# Altium schematic sheet Sheet1.SchDoc
size A4; SheetNumber: 1; SheetTotal: 1
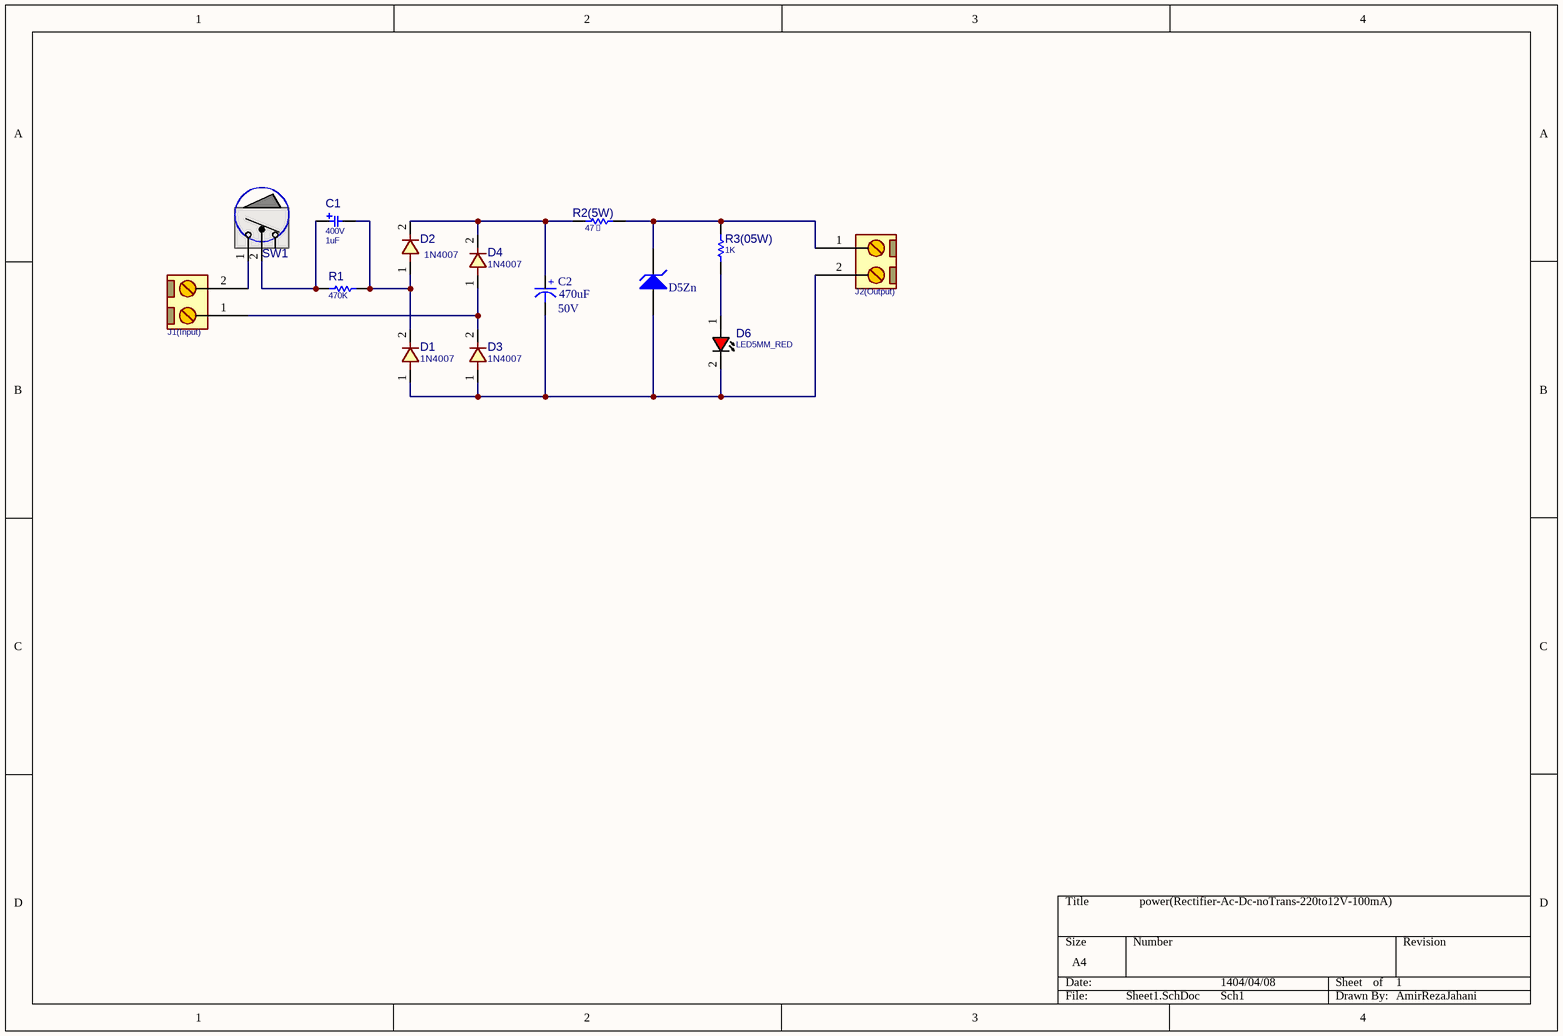
[diagram p0: Sheet1.SchDoc]

## Parts
C1  PARAM2: 400V  [C_FLM_22X7H14]  (hidden comment: 1uF)
C2  Voltage: 50V  [cap 03]  (hidden comment: 470uF)
D1  1N4007  [D_AX04_DO41]
D2  1N4007  [D_AX04_DO41]
D3  1N4007  [D_AX04_DO41]
D4  1N4007  [D_AX04_DO41]
D5Zn  Diode Zener  [Diode 1W]  (value not drawn)
D6  LED5MM_RED  [LED5MM_RED]
J1(Input)  CONN_TB2  [TBG_2]  (value not drawn)
J2(Output)  CONN_TB2  [MSTB_2]  (value not drawn)
R1  470K  [R025W_AX04]
R2(5W)  47ꭥ  [RWW5W]
R3(05W)  1K  [R05W_AX05]
SW1  ToggleSwitch  [SWRCK_SPST_S_15X10]  (value not drawn)

## Nets
NetC1_1: C1.1 R1.1 SW1.2(COM)
NetC1_2: C1.2 D1.2 D2.1 R1.2
NetC2_1: C2.1(+) D2.2 D4.2 R2(5W).1
NetC2_2: C2.2(-) D1.1 D3.1 D5Zn.1(A) D6.2(CATHODE) J2(Output).2
NetD3_2: D3.2 D4.1 J1(Input).1
NetD5Zn_2: D5Zn.2(K) J2(Output).1 R2(5W).2 R3(05W).1
NetD6_1: D6.1(ANODE) R3(05W).2
NetJ1(Input)_2: J1(Input).2 SW1.1(T1)

## Notes on the sheet
- power(Rectifier-Ac-Dc-noTrans-220to12V-100mA)
- 1404/04/08
- 1
- Sch1
- AmirRezaJahani

## Library data of the parts
C1 = CAP_THD_FLM_0.47uF_400v: CAP, THD, FILM,; MANF_P#: MANF_PART#; DESC: DESCRIPTION; DIST#: MOUSER; PARAM: 20%; PRICE: 10= 5$; MANF: MANF; ASSEMBLY: ASSEMBLY; VALUE: 1uF
C2 = Cap-Polar: Polar Capacitor; Designer: Saeid Jorablo; Organazation: ControTec; Adding Date: 1387/12/20; Value: 470uF
D1-D4 = DIODE_THD: DIODE, THD; DESC: DESCRIPTION; PARAM: 100V; PARAM2: 1A; MANF_P#: 1N4001; MANF: MANF; ASSEMBLY: ASSEMBLY; PRICE: PRICE; VALUE: 1N4007
D5Zn = Diode Zener: Zener Diode; Designer: Saeid Jorablo; Company: E.P.I.L; Voltage: 3.3 V; Design Date: 2011/11/02
D6 = LED_THD_5MM_RED: LED, THD, 5MM, RED; DESC: DESCRIPTION; MANF_P#: MANF_PART#; PARAM2: 2.2V; MANF: MANF; ASSEMBLY: ASSEMBLY; PRICE: PRICE; VALUE: LED5MM_RED
J1(Input) = CONN_TB2: CONN, TERMINAL BLOCK, 5.08mm pitch; VALUE: CONN_TB2
J2(Output) = CONN_MSTB_2: CONN, PHOENIX MSTB, 5-G, 5.08mm pitch; PARAM2: 320V; PARAM: 12A; VALUE: CONN_TB2
R1 R2(5W) R3(05W) = RES_THD: RESISTOR, THD; MANF_P#: RK73H1ETTP4701F; MANF: KOA SPEER; PARAM: 0.063W; DESC: DESCRIPTION; DIST#: MOUSER; PARAM2: 1%; ASSEMBLY: ASSEMBLY; PRICE: 100= 0.5$
  R1: VALUE: 470K
  R2(5W): VALUE: 47ꭥ
  R3(05W): VALUE: 1K
SW1 = SWROK_SPST_R_15X10: SWITCH, Rocker, SPST, THD, 15x10.5mm; DESC: DESCRIPTION; MANF: -; MANF_PART#: -; VALUE: ToggleSwitch; ASSEMBLY: ASSEMBLY; PARAM: -; PRICE: -